# Altium schematic sheet usb_connectors.SchDoc
size A
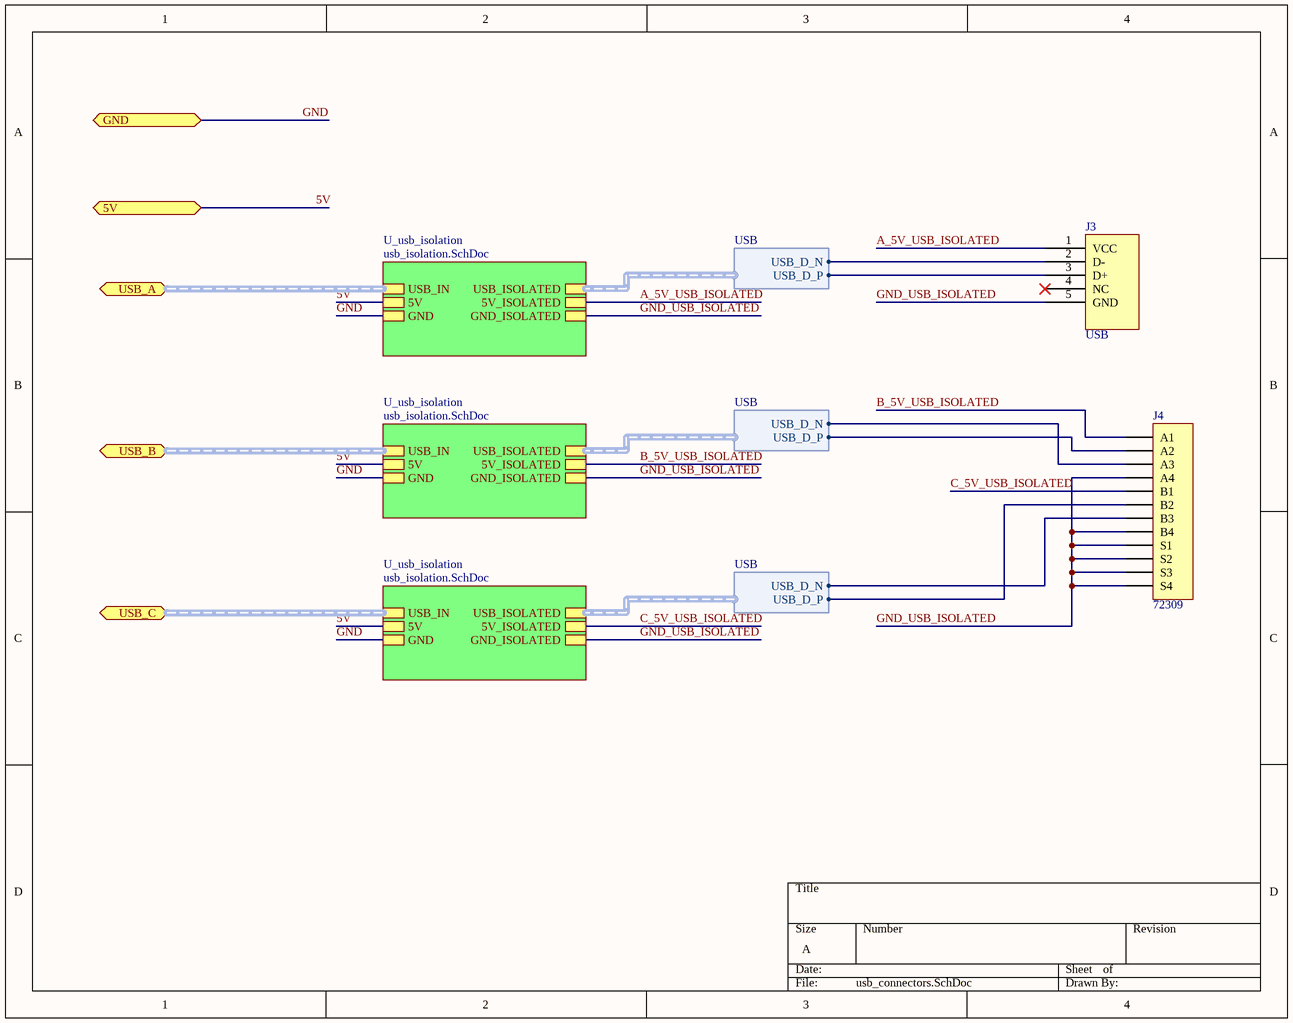
[diagram p0: usb_connectors.SchDoc]

## Parts
J3  USB  [DX2R005HN2E700]
J4  72309  [72309]

## Sub-sheets
U_usb_isolation = usb_isolation.SchDoc: USB_IN (harness USB), USB_ISOLATED (harness USB), 5V_ISOLATED, 5V, GND_ISOLATED, GND
U_usb_isolation = usb_isolation.SchDoc: USB_IN (harness USB), USB_ISOLATED (harness USB), 5V_ISOLATED, 5V, GND_ISOLATED, GND
U_usb_isolation = usb_isolation.SchDoc: USB_IN (harness USB), USB_ISOLATED (harness USB), 5V_ISOLATED, 5V, GND_ISOLATED, GND

## Ports
5V, GND, USB_A (harness USB), USB_B (harness USB), USB_C (harness USB)

## Harnesses
USB: USB_D_N, USB_D_P

## Nets
5V: port 5V, sheet U_usb_isolation/5V, sheet U_usb_isolation/5V, sheet U_usb_isolation/5V
A_5V_USB_ISOLATED: J3.1(VCC) ; sheet U_usb_isolation/5V_ISOLATED
B_5V_USB_ISOLATED: J4.A1 ; sheet U_usb_isolation/5V_ISOLATED
C_5V_USB_ISOLATED: J4.B1 ; sheet U_usb_isolation/5V_ISOLATED
GND: port GND, sheet U_usb_isolation/GND, sheet U_usb_isolation/GND, sheet U_usb_isolation/GND
GND_USB_ISOLATED: J3.5(GND) J4.A4 J4.B4 J4.S1 J4.S2 J4.S3 J4.S4 ; sheet U_usb_isolation/GND_ISOLATED, sheet U_usb_isolation/GND_ISOLATED, sheet U_usb_isolation/GND_ISOLATED
NetJ3_2: J3.2(D-) ; sheet U_usb_isolation/USB_ISOLATED.USB_D_N
NetJ3_3: J3.3(D+) ; sheet U_usb_isolation/USB_ISOLATED.USB_D_P
NetJ4_A2: J4.A2 ; sheet U_usb_isolation/USB_ISOLATED.USB_D_P
NetJ4_A3: J4.A3 ; sheet U_usb_isolation/USB_ISOLATED.USB_D_N
NetJ4_B2: J4.B2 ; sheet U_usb_isolation/USB_ISOLATED.USB_D_P
NetJ4_B3: J4.B3 ; sheet U_usb_isolation/USB_ISOLATED.USB_D_N

Not connected (* = marked no-connect by the designer): J3 4(NC)*

## Buses and harness runs
harness port USB_A = sheet U_usb_isolation/USB_IN
harness port USB_B = sheet U_usb_isolation/USB_IN
harness port USB_C = sheet U_usb_isolation/USB_IN

## Library data of the parts
J3 = DX2R005HN2E700: USB mini-B receptacle; Manufacturer: JAE Electronics; Manufacturer P/N: DX2R005HN2E700; Distributor: DigiKey; Distributor P/N: 670-1190-1-ND
J4 = 72309: USB Double Deck Receptacle; Manufacturer: FCI; Manufacturer P/N: 72309; Distributor: DigiKey; Distributor P/N: 609-1040-ND